# EAGLE schematic Whale_Engine-REVB_eagle (EAGLE 9.5.2)
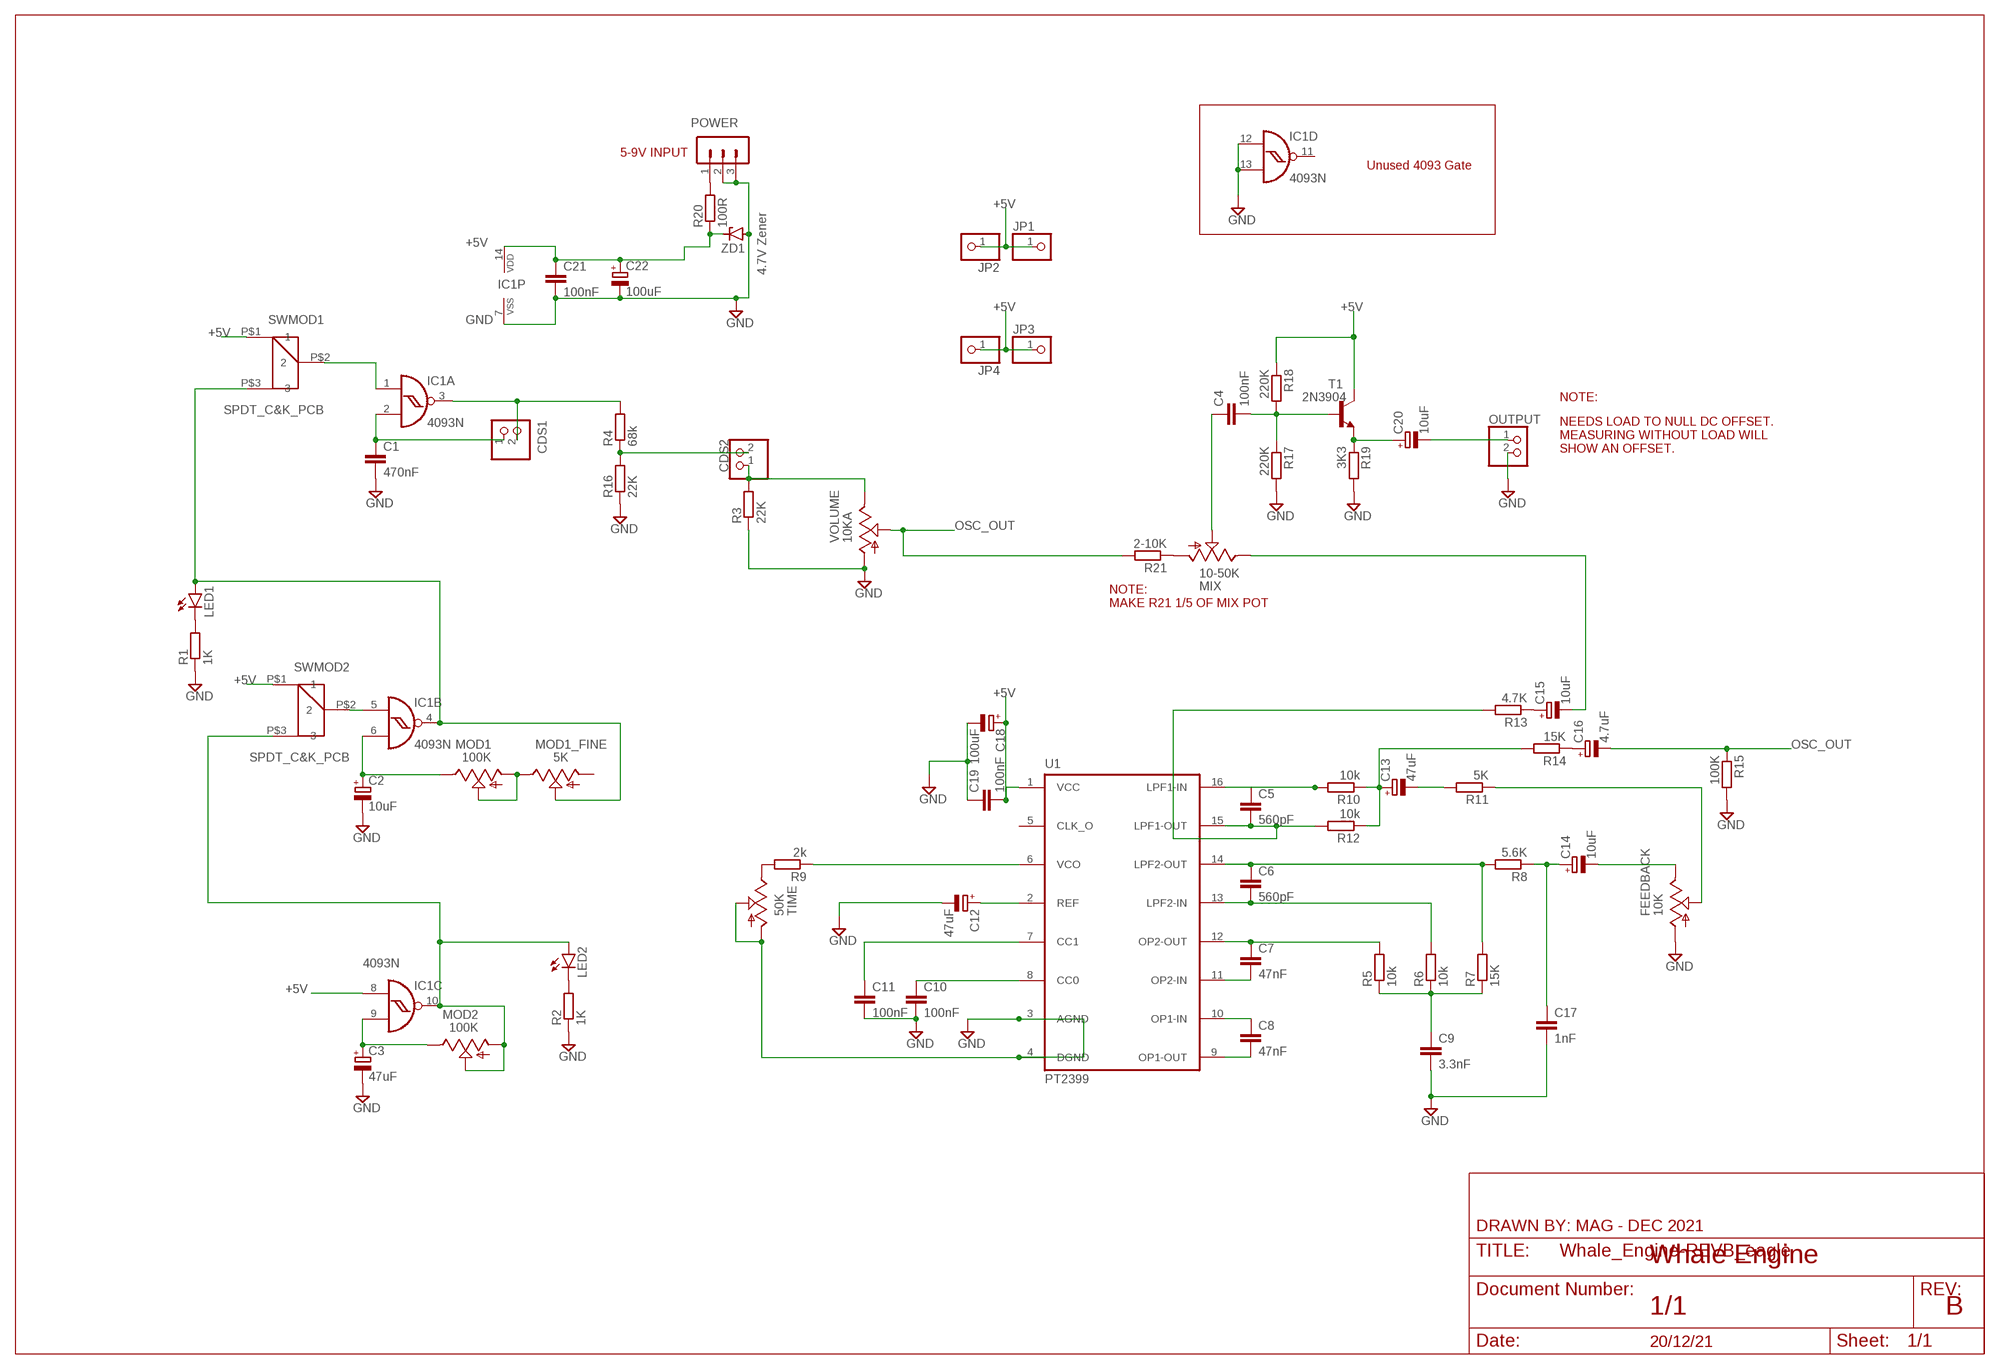
[diagram p0: schematic, sheet 1]

## Parts
C1  470nF  C7.5/3  [C7.5B3]
C2  10uF  CPOL-EUE2-5  [E2-5]
C3  47uF  CPOL-EUE2-5  [E2-5]
C4  100nF  C-EU050-025X075  [C050-025X075]
C5  560pF  C2.5/2  [C2.5-2]
C6  560pF  C2.5/2  [C2.5-2]
C7  47nF  C2.5/2  [C2.5-2]
C8  47nF  C2.5/2  [C2.5-2]
C9  3.3nF  C2.5/2  [C2.5-2]
C10  100nF  C2.5/2  [C2.5-2]
C11  100nF  C2.5/2  [C2.5-2]
C12  47uF  CPOL-EUE2-5  [E2-5]
C13  47uF  CPOL-EUE2-5  [E2-5]
C14  10uF  CPOL-EUE2-5  [E2-5]
C15  10uF  CPOL-EUE2-5  [E2-5]
C16  4.7uF  CPOL-EUE2-5  [E2-5]
C17  1nF  C2.5/2  [C2.5-2]
C18  100uF  CPOL-EUE2-5  [E2-5]
C19  100nF  C2.5/2  [C2.5-2]
C20  10uF  CPOL-EUE2-5  [E2-5]
C21  100nF  C2.5/2  [C2.5-2]
C22  100uF  CPOL-EUE2-5  [E2-5]
CDS1  PINHD-1X2  [1X02]
CDS2  PINHD-1X2  [1X02]
FEEDBACK  10K  9MM_SNAP-IN_POT_  [9MM_SNAP-IN_POT]
IC1  4093N  [DIL14]
JP1  PINHD-1X1  [1X01]
JP2  PINHD-1X1  [1X01]
JP3  PINHD-1X1  [1X01]
JP4  PINHD-1X1  [1X01]
LED1  LED3MM  [LED3MM]
LED2  LED3MM  [LED3MM]
MIX  10-50K  9MM_SNAP-IN_POT_  [9MM_SNAP-IN_POT]
MOD1  100K  9MM_SNAP-IN_POT_  [9MM_SNAP-IN_POT]
MOD1_FINE  5K  9MM_SNAP-IN_POT_  [9MM_SNAP-IN_POT]
MOD2  100K  9MM_SNAP-IN_POT_  [9MM_SNAP-IN_POT]
OUTPUT  PINHD-1X2  [1X02]
POWER  MA03-1  [MA03-1]
R1  1K  R-EU_0204/7  [0204/7]
R2  1K  R-EU_0204/7  [0204/7]
R3  22K  R-EU_0204/7  [0204/7]
R4  68k  R-EU_0204/7  [0204/7]
R5  10k  R-EU_0204/7  [0204/7]
R6  10k  R-EU_0204/7  [0204/7]
R7  15K  R-EU_0204/7  [0204/7]
R8  5.6K  R-EU_0204/7  [0204/7]
R9  2k  R-EU_0204/7  [0204/7]
R10  10k  R-EU_0204/7  [0204/7]
R11  5K  R-EU_0204/7  [0204/7]
R12  10k  R-EU_0204/7  [0204/7]
R13  4.7K  R-EU_0204/7  [0204/7]
R14  15K  R-EU_0204/7  [0204/7]
R15  100K  R-EU_0204/7  [0204/7]
R16  22K  R-EU_0204/7  [0204/7]
R17  220K  R-EU_0204/7  [0204/7]
R18  220K  R-EU_0204/7  [0204/7]
R19  3K3  R-EU_0204/7  [0204/7]
R20  100R  R-EU_0204/7  [0204/7]
R21  2-10K  R-EU_0204/7  [0204/7]
SWMOD1  SPDT_C&K_PCB  [C&K_SPDT_PCB]
SWMOD2  SPDT_C&K_PCB  [C&K_SPDT_PCB]
T1  2N3904  [TO92]
TIME  50K  9MM_SNAP-IN_POT_  [9MM_SNAP-IN_POT]
U1  PT2399  [DIL16]
VOLUME  10KA  9MM_SNAP-IN_POT_  [9MM_SNAP-IN_POT]
ZD1  4.7V Zener  BZD23  [SOD81]

## Nets
+5V: C18.+ C19.2 C21.1 C22.+ IC1.8(C:I0) IC1.14(P:VDD) JP1.1 JP2.1 JP3.1 JP4.1 R18.1 R20.1 SWMOD1.P$1 SWMOD2.P$1 T1.1(C) U1.1(VCC) ZD1.C
GND: C1.2 C2.- C3.- C9.2 C10.2 C11.2 C12.- C17.2 C18.- C19.1 C21.2 C22.- FEEDBACK.1(A) IC1.7(P:VSS) IC1.12(D:I0) IC1.13(D:I1) OUTPUT.2 POWER.2 POWER.3 R1.1 R2.1 R3.1 R15.2 R16.1 R17.2 R19.2 TIME.1(A) TIME.2(S) U1.3(AGND) U1.4(DGND) VOLUME.1(A) ZD1.A
N$1: IC1.1(A:I0) SWMOD1.P$2
N$2: IC1.5(B:I0) SWMOD2.P$2
N$3: C2.+ IC1.6(B:I1) MOD1.3(E)
N$4: MOD1.1(A) MOD1.2(S) MOD1_FINE.3(E)
N$5: IC1.4(B:O) LED1.A MOD1_FINE.2(S) SWMOD1.P$3
N$6: IC1.10(C:O) LED2.A MOD2.1(A) MOD2.2(S) SWMOD2.P$3
N$7: C1.1 CDS1.1 IC1.2(A:I1)
N$8: CDS1.2 IC1.3(A:O) R4.2
N$9: LED1.K(C) R1.2
N$10: LED2.K(C) R2.2
N$11: C3.+ IC1.9(C:I1) MOD2.3(E)
N$12: CDS2.2 R4.1 R16.2
N$13: CDS2.1 R3.2 VOLUME.3(E)
N$14: C5.1 R10.2 U1.16(LPF1-IN)
N$15: C5.2 R12.2 R13.2 U1.15(LPF1-OUT)
N$16: C6.1 R7.2 R8.2 U1.14(LPF2-OUT)
N$17: C6.2 R6.2 U1.13(LPF2-IN)
N$18: C7.1 R5.2 U1.12(OP2-OUT)
N$19: C7.2 U1.11(OP2-IN)
N$20: C8.1 U1.10(OP1-IN)
N$21: C8.2 U1.9(OP1-OUT)
N$22: C9.1 R5.1 R6.1 R7.1
N$23: C10.1 U1.8(CC0)
N$24: C11.1 U1.7(CC1)
N$25: R9.1 U1.6(VCO)
N$26: R9.2 TIME.3(E)
N$27: C4.2 R17.1 R18.2 T1.2(B)
N$28: C12.+ U1.2(REF)
N$29: C13.+ R10.1 R12.1 R14.2
N$30: C13.- R11.2
N$31: FEEDBACK.2(S) R11.1
N$32: C14.- FEEDBACK.3(E)
N$33: C14.+ C17.1 R8.1
N$34: C15.+ R13.1
N$35: C4.1 MIX.2(S)
N$36: C16.+ R14.1
N$37: C20.+ R19.1 T1.3(E)
N$38: C20.- OUTPUT.1
N$39: C15.- MIX.3(E)
N$40: MIX.1(A) R21.1
N$41: POWER.1 R20.2
OSC_OUT: C16.- R15.1 R21.2 VOLUME.2(S)
Unconnected: IC1.11(D:O) MOD1_FINE.1(A) U1.5(CLK_O)

## Notes on the sheet
- 5-9V INPUT
- Unused 4093 Gate
- NOTE:
- NEEDS LOAD TO NULL DC OFFSET.
  MEASURING WITHOUT LOAD WILL 
  SHOW AN OFFSET.
- NOTE:
  MAKE R21 1/5 OF MIX POT
- DRAWN BY: MAG - DEC 2021
- Whale Engine
- 1/1 | B
- 20/12/21

## Library data of the parts
C1 C5-C11 C17 C19 C21 = capacitor-wima:C: CAPACITOR naming: grid - package width
C2 C3 C12-C16 C18 C20 C22 = rcl:CPOL-EU: POLARIZED CAPACITOR, European symbol; SPICEPREFIX: C
C4 = rcl:C-EU: CAPACITOR, European symbol; SPICEPREFIX: C
CDS1 CDS2 OUTPUT = pinhead:PINHD-1X2: PIN HEADER
FEEDBACK MIX MOD1 MOD1_FINE MOD2 TIME VOLUME = MusicThingModular:9MM_SNAP-IN_POT: 9mm vertical snap-in pot, Alpha / Panasonic style
IC1 = 40xx:4093: Quad 2-input NAND schmitt trigger
JP1-JP4 = pinhead:PINHD-1X1: PIN HEADER
LED1 LED2 = led:LED: LED OSRAM: - CHIPLED LG R971, LG N971, LY N971, LG Q971, LY Q971, LO R971, LY R971 LH N974, LH R974 LS Q976, LO Q976, LY Q976 LO Q996 - Hyper CHIPLED LW Q18S LB Q993, LB Q99A, LB R99A - SideLED LS A670, LO A670, LY A670, LG A670, LP A670 LB A673, LV A673, LT A673, LW A673 LH A674 LY A675 LS A676, LA A676, LO A676, LY A676, LW A676 LS A679, LY A679, LG A679 - Hyper Micro SIDELED® LS Y876, LA Y876, LO Y876, LY Y876 LT Y87S - SmartLED LW L88C, LW L88S LB L89C, LB L89S, LG L890 LS L89K, LO L89K, LY L89K LS L896, LA L896, LO L896, LY L896 - TOPLED LS T670, LO T670, LY T670, LG T670, LP T670 LSG T670, LSP T670, LSY T670, LOP T670, LYG T670 LG T671, LOG T671, LSG T671 LB T673, LV T673, LT T673, LW T673 LH T674 LS T676, LA T676, LO T676, LY T676, LB T676, LH T676, LSB T676, LW T676 LB T67C, LV T67C, LT T67C, LS T67K, LO T67K, LY T67K, LW E67C LS E67B, LA E67B, LO E67B, LY E67B, LB E67C, LV E67C, LT E67C LW T67C LS T679, LY T679, LG T679 LS T770, LO T770, LY T770, LG T770, LP T770 LB T773, LV T773, LT T773, LW T773 LH T774 LS E675, LA E675, LY E675, LS T675 LS T776, LA T776, LO T776, LY T776, LB T776 LHGB T686 LT T68C, LB T68C - Hyper Mini TOPLED® LB M676 - Mini TOPLED Santana® LG M470 LS M47K, LO M47K, LY M47K Source: http://www.osram.convergy.de LUXEON: - LUMILED® LXK2-PW12-R00, LXK2-PW12-S00, LXK2-PW14-U00, LXK2-PW14-V00 LXK2-PM12-R00, LXK2-PM12-S00, LXK2-PM14-U00 LXK2-PE12-Q00, LXK2-PE12-R00, LXK2-PE12-S00, LXK2-PE14-T00, LXK2-PE14-U00 LXK2-PB12-K00, LXK2-PB12-L00, LXK2-PB12-M00, LXK2-PB14-N00, LXK2-PB14-P00, LXK2-PB14-Q00 LXK2-PR12-L00, LXK2-PR12-M00, LXK2-PR14-Q00, LXK2-PR14-R00 LXK2-PD12-Q00, LXK2-PD12-R00, LXK2-PD12-S00 LXK2-PH12-R00, LXK2-PH12-S00 LXK2-PL12-P00, LXK2-PL12-Q00, LXK2-PL12-R00 Source: www.luxeon.com KINGBRIGHT: KA-3528ASYC Source: www.kingbright.com
POWER = con-lstb:MA03-1: PIN HEADER; OC_FARNELL: unknown; OC_NEWARK: unknown
R1-R21 = rcl:R-EU_: RESISTOR, European symbol; SPICEPREFIX: R
SWMOD1 SWMOD2 = DACS:SPDT_C&K_PCB
T1 = transistor:2N3904: NPN TRANSISTOR
U1 = princeton-tech:PT2399: Echo Processor IC
ZD1 = diode:BZD23: Z DIODE